# EAGLE design Task3 (EAGLE 9.5.1)
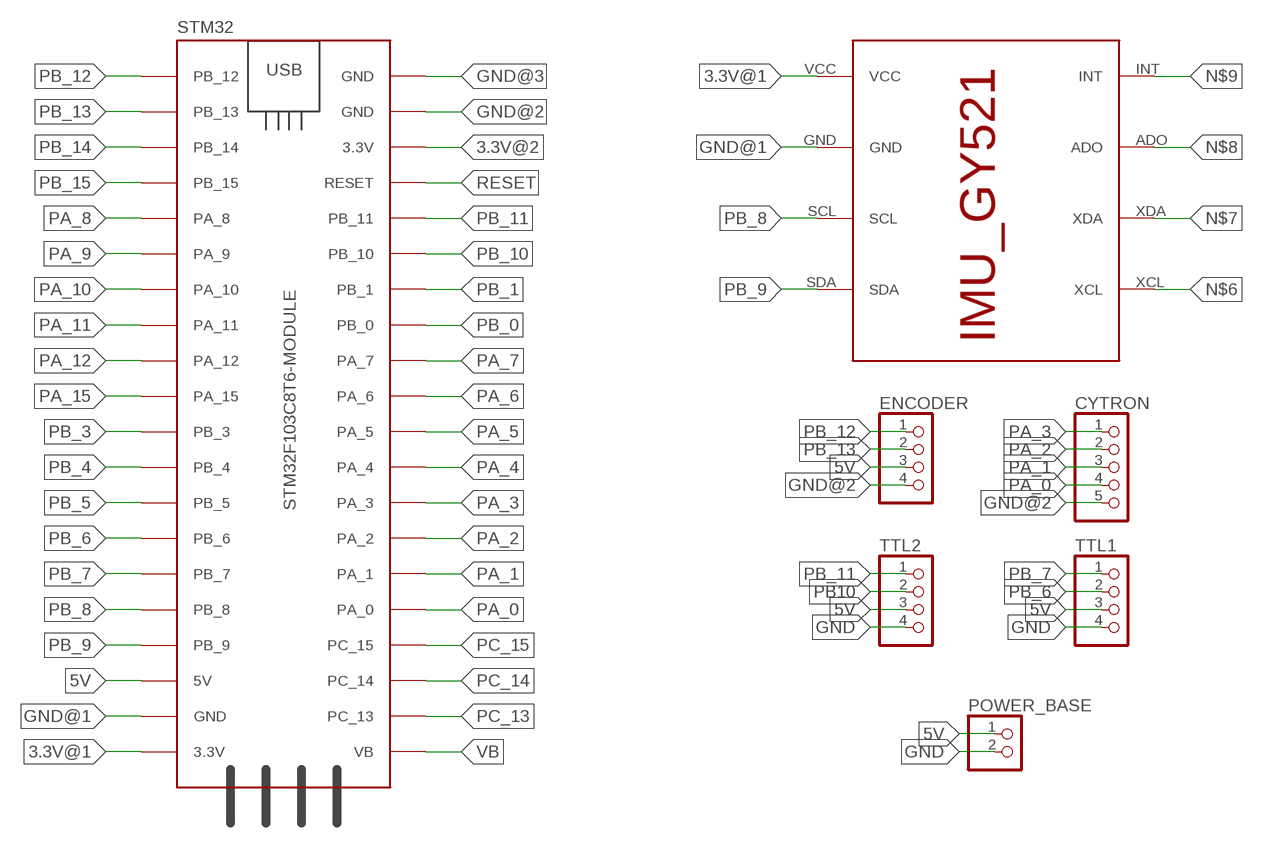
[diagram p0: schematic, sheet 1]

## Parts
CYTRON  PINHD-5_DATA  [1X05_DATA]
ENCODER  PINHD-4_DATA  [1X04_DATA]
POWER_BASE  PINHD-2_DATA  [1X02_DATA]
STM32  STM32F103C8T6-MODULE  [STM32F103C8T6-MODULE]
TTL1  PINHD-4_DATA  [1X04_DATA]
TTL2  PINHD-4_DATA  [1X04_DATA]
U$1  IMU_ROBOCON_GY521  [IMU_GY521]

## Nets
3.3V@1: STM32.3.3V_1(3.3V) U$1.VCC
3.3V@2: STM32.3.3V_2(3.3V)
5V: ENCODER.3 POWER_BASE.1 STM32.5V TTL1.3 TTL2.3
GND: POWER_BASE.2 TTL1.4 TTL2.4
GND@1: STM32.GND_1(GND) U$1.GND
GND@2: CYTRON.5 ENCODER.4 STM32.GND_2(GND)
GND@3: STM32.GND_3(GND)
N$6: U$1.XCL
N$7: U$1.XDA
N$8: U$1.ADO
N$9: U$1.INT
PA_0: CYTRON.4 STM32.PA_0
PA_1: CYTRON.3 STM32.PA_1
PA_2: CYTRON.2 STM32.PA_2
PA_3: CYTRON.1 STM32.PA_3
PA_4: STM32.PA_4
PA_5: STM32.PA_5
PA_6: STM32.PA_6
PA_7: STM32.PA_7
PA_8: STM32.PA_8
PA_9: STM32.PA_9
PA_10: STM32.PA_10
PA_11: STM32.PA_11
PA_12: STM32.PA_12
PA_15: STM32.PA_15
PB10: TTL2.2
PB_0: STM32.PB_0
PB_1: STM32.PB_1
PB_3: STM32.PB_3
PB_4: STM32.PB_4
PB_5: STM32.PB_5
PB_6: STM32.PB_6 TTL1.2
PB_7: STM32.PB_7 TTL1.1
PB_8: STM32.PB_8 U$1.SCL
PB_9: STM32.PB_9 U$1.SDA
PB_10: STM32.PB_10
PB_11: STM32.PB_11 TTL2.1
PB_12: ENCODER.1 STM32.PB_12
PB_13: ENCODER.2 STM32.PB_13
PB_14: STM32.PB_14
PB_15: STM32.PB_15
PC_13: STM32.PC_13
PC_14: STM32.PC_14
PC_15: STM32.PC_15
RESET: STM32.RESET
VB: STM32.VB

## Library data of the parts
CYTRON = MIA_LIBRARY-2-2-2:PINHD-5_DATA: PIN HEADER
ENCODER TTL1 TTL2 = MIA_LIBRARY-2-2-2:PINHD-4_DATA: PIN HEADER
POWER_BASE = MIA_LIBRARY-2-2-2:PINHD-2_DATA: PIN HEADER
STM32 = MIA_LIBRARY-2-2-2:STM32F103C8T6-MODULE: STM32F103C8T6 module with ARM Cortex-3, 20kB SRAM, 64kB Flash, 72MHz
U$1 = MIA_LIBRARY-2-2-2:IMU_ROBOCON_GY521

## Board
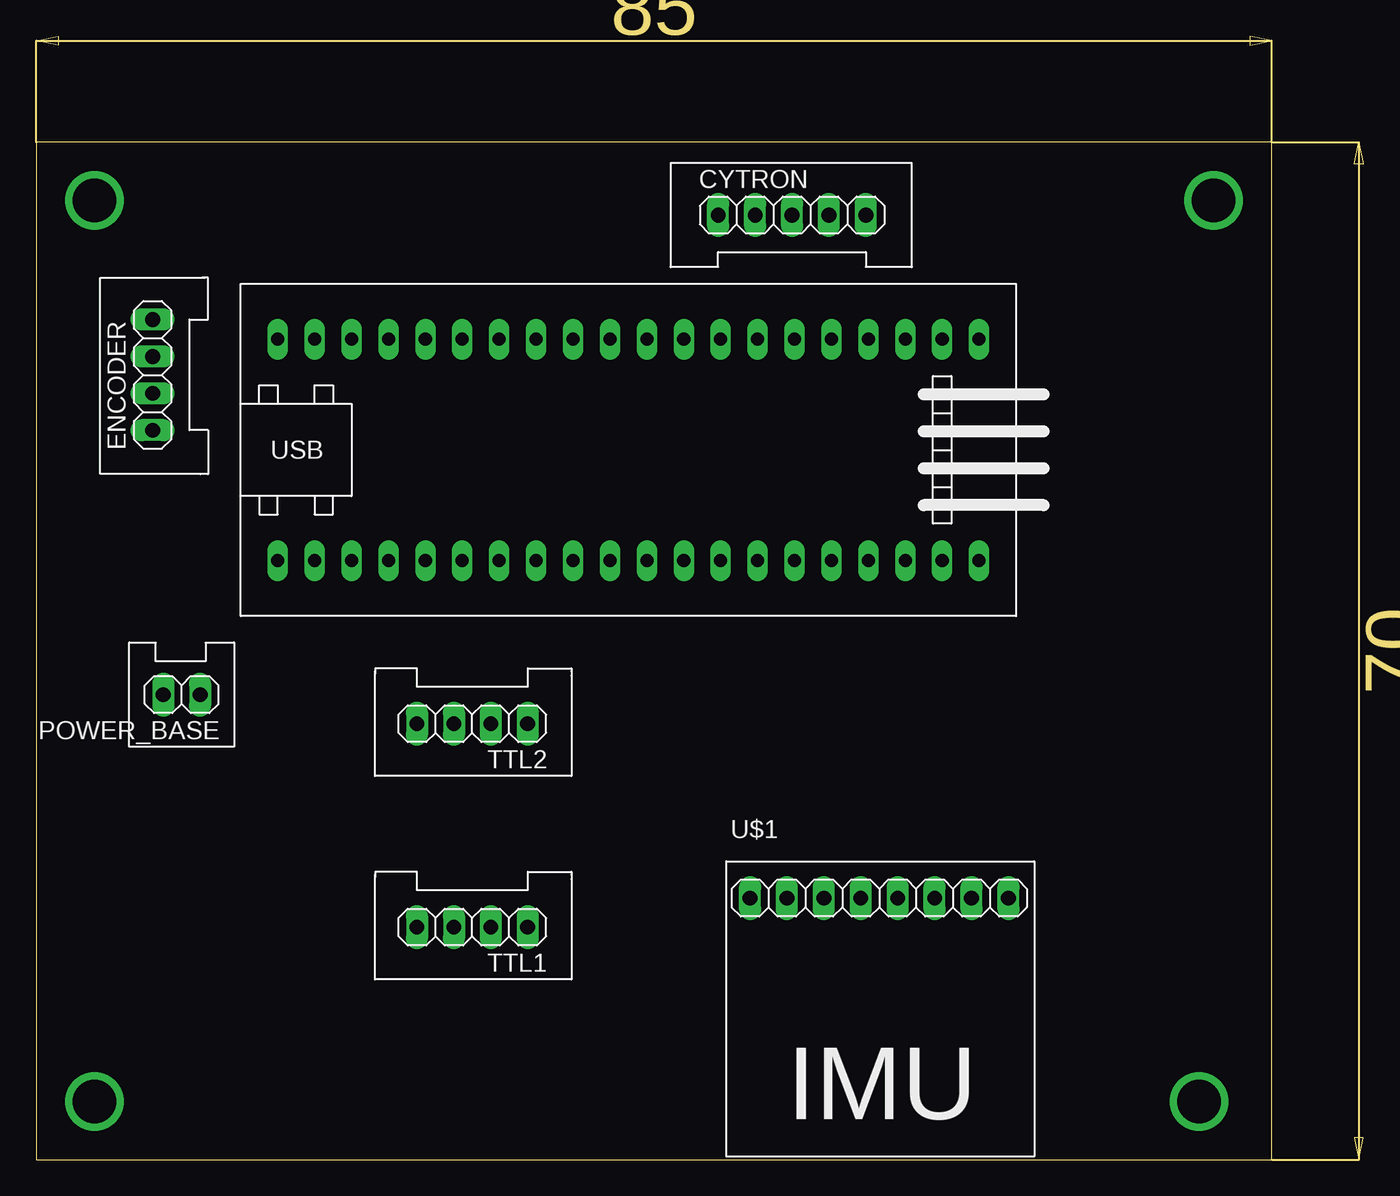
[diagram p1: board, top side]
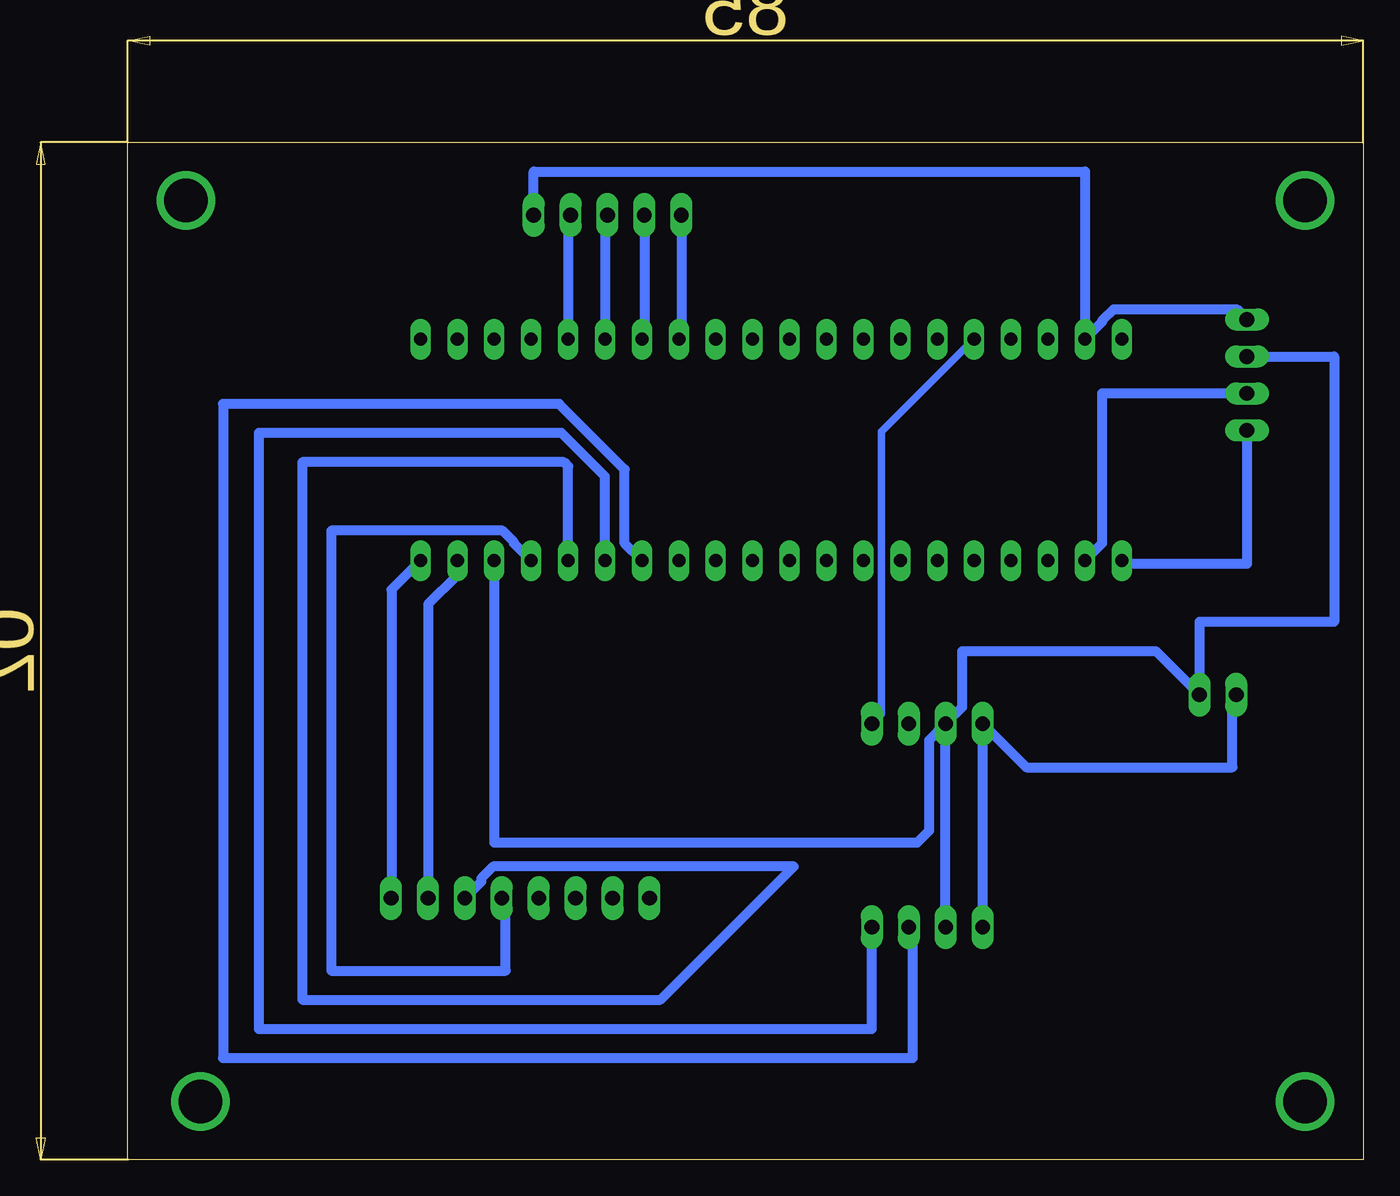
[diagram p2: board, bottom side, seen from below]

Size 85 x 70 mm. Coordinates in mm from the lower left corner, seen from the top.
Outline: 0,0 85,0 85,70 0,70 0,0
Copper layers (1*16): Top 0.035mm / dielectric 1.5mm / Bottom 0.035mm
Design rules "default *": minimum track width 6mil, minimum drill 0.8mm, track to track 0.6mm, track to pad 0.3mm, pad to pad 0.6mm, via to via 0.6mm, smd to smd 0.6mm, copper to edge 0.2mm, drill to drill 0.2mm, minimum pad ring 10mil, minimum via ring 8mil, stop-mask expansion 4mil, vias tented up to drill 0mil, thermal gap 10mil

### Footprints (pad centres in the part's own frame; a part is rotated, then mirrored left to right if it is on the bottom)
1X05_DATA = drill 1.016 long: 1 -5.08,0; 2 -2.54,0; 3 0,0; 4 2.54,0; 5 5.08,0
1X04_DATA = drill 1.016 long: 1 -3.81,0; 2 -1.27,0; 3 1.27,0; 4 3.81,0
1X02_DATA = drill 1.016 long: 1 -1.27,0; 2 1.27,0
STM32F103C8T6-MODULE = drill 0.9 long: 3.3V_1 25.4,-7.62; 3.3V_2 -17.78,7.62; 5V 20.32,-7.62; GND_1 22.86,-7.62; GND_2 -20.32,7.62; GND_3 -22.86,7.62; PA_0 15.24,7.62; PA_1 12.7,7.62; PA_2 10.16,7.62; PA_3 7.62,7.62; PA_4 5.08,7.62; PA_5 2.54,7.62; PA_6 0,7.62; PA_7 -2.54,7.62; PA_8 -12.7,-7.62; PA_9 -10.16,-7.62; PA_10 -7.62,-7.62; PA_11 -5.08,-7.62; PA_12 -2.54,-7.62; PA_15 0,-7.62; PB_0 -5.08,7.62; PB_1 -7.62,7.62; PB_3 2.54,-7.62; PB_4 5.08,-7.62; PB_5 7.62,-7.62; PB_6 10.16,-7.62; PB_7 12.7,-7.62; PB_8 15.24,-7.62; PB_9 17.78,-7.62; PB_10 -10.16,7.62; PB_11 -12.7,7.62; PB_12 -22.86,-7.62; PB_13 -20.32,-7.62; PB_14 -17.78,-7.62; PB_15 -15.24,-7.62; PC_13 22.86,7.62; PC_14 20.32,7.62; PC_15 17.78,7.62; RESET -15.24,7.62; VB 25.4,7.62
IMU_GY521 = drill 1.016 long: ADO -6.35,0; GND 6.35,0; INT -8.89,0; SCL 3.81,0; SDA 1.27,0; VCC 8.89,0; XCL -3.81,0; XDA -1.27,0

### Placement (x,y rotation side)
CYTRON  52,65 0 top
ENCODER  8,54 90 top
POWER_BASE  10,32 180 top
STM32  39.47,48.84 0 top
TTL1  30,16 180 top
TTL2  30,30 180 top
U$1  58,18 0 top

### Tracks (layer width: path | path; a pad name or v marks a point on that pad's centre or on a via)
3.3V@1
  Bottom 0.7: U$1.VCC 66.87,18.02 66.87,39.22 STM32.3.3V_1
5V
  Bottom 0.7: STM32.5V 59.79,21.83 30.69,21.83 29.86,22.65 29.86,28.87 TTL2.3 | TTL1.3 TTL2.3 | TTL2.3 27.6,31.13 27.6,35 14.27,35 POWER_BASE.1 11.27,37 2,37 2,55.27 ENCODER.3
GND
  Bottom 0.7: TTL1.4 TTL2.4 23.19,27 9,27 9,31.73 POWER_BASE.2
GND@1
  Bottom 0.7: U$1.GND 64.33,18.02 64.33,38.22 62.33,40.22 STM32.GND_1
GND@2
  Bottom 0.7: CYTRON.5 57.08,68 19.15,68 STM32.GND_2 17.96,57.65 17.96,57.72 17.17,58.52 8.71,58.52 ENCODER.4
N$1  (via drill 3 pad 3)
  other vias: 4,66
N$2  (via drill 3 pad 3)
  other vias: 81,66
N$3  (via drill 3 pad 3)
  other vias: 80,4
N$4  (via drill 3 pad 3)
  other vias: 4,4
PA_0
  Bottom 0.7: CYTRON.4 54.71,64.83 STM32.PA_0
PA_1
  Bottom 0.7: CYTRON.3 52.17,64.83 STM32.PA_1
PA_2
  Bottom 0.7: CYTRON.2 49.46,56.63 STM32.PA_2
PA_3
  Bottom 0.7: CYTRON.1 46.92,56.63 STM32.PA_3
PB_6
  Bottom 0.7: STM32.PB_6 50.82,42.41 50.82,47.49 55.32,52 78.45,52 78.45,7 31,7 31,15.73 TTL1.2
PB_7
  Bottom 0.7: STM32.PB_7 52.17,47.01 55.16,50 76,50 76,9 33.81,9 TTL1.1
PB_8
  Bottom 0.7: STM32.PB_8 54.71,47.71 55,48 73,48 73,11 48.35,11 39.18,20.17 59.86,20.17 60.68,19.35 60.68,19.13 U$1.SCL
PB_9
  Bottom 0.7: STM32.PB_9 58.44,42.41 58.44,42.48 59.23,43.28 71,43.28 71,13 59,13 59,17.73 U$1.SDA
PB_11
  Bottom 0.5: TTL2.1 33.14,30.67 33.14,50.09 STM32.PB_11
PB_12
  Bottom 0.7: ENCODER.1 8,41 16.39,41 STM32.PB_12
PB_13
  Bottom 0.7: STM32.PB_13 17.96,42.41 17.96,52.73 ENCODER.2